# Altium schematic sheet [06] - 8051.SchDoc: Mantra Display Board
size A4; Author: MikrySoft; Address1: MikrySoft@gmail.com; DocumentNumber: 7; Revision: 1; SheetNumber: 7; SheetTotal: 7
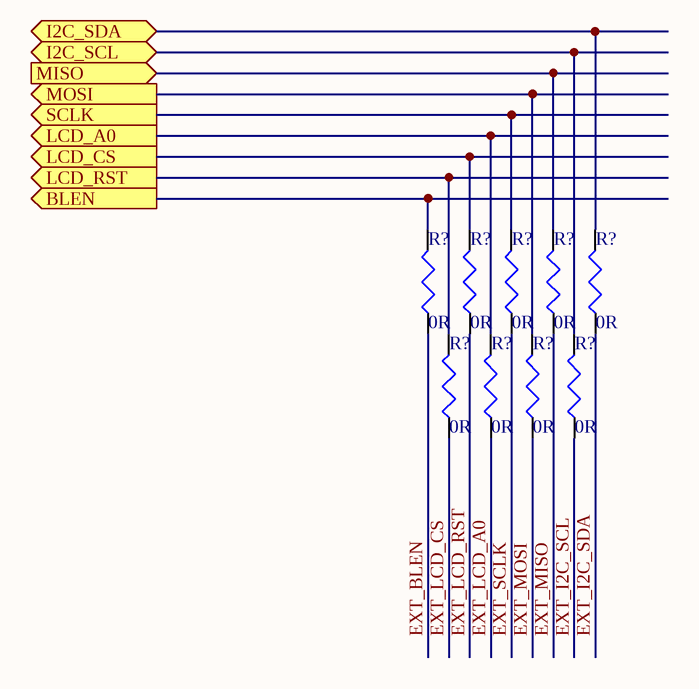
[diagram p0: [06] - 8051.SchDoc]

## Parts
(Parts that share a designator on the sheet are numbered #1, #2 ... from top to bottom, then left to right.)
R?#1  value 0R  [J1-0603]  (hidden comment: Res3)
R?#2  value 0R  [J1-0603]  (hidden comment: Res3)
R?#3  value 0R  [J1-0603]  (hidden comment: Res3)
R?#4  value 0R  [J1-0603]  (hidden comment: Res3)
R?#5  value 0R  [J1-0603]  (hidden comment: Res3)
R?#6  value 0R  [J1-0603]  (hidden comment: Res3)
R?#7  value 0R  [J1-0603]  (hidden comment: Res3)
R?#8  value 0R  [J1-0603]  (hidden comment: Res3)
R?#9  value 0R  [J1-0603]  (hidden comment: Res3)

## Ports
BLEN (out), I2C_SCL (bidir), I2C_SDA (bidir), LCD_A0 (out), LCD_CS (out), LCD_RST (out), MISO (in), MOSI (out), SCLK (out)

## Nets
BLEN: R?#1.2 ; port BLEN
EXT_BLEN: R?#1.1
EXT_I2C_SCL: R?#9.1
EXT_I2C_SDA: R?#5.1
EXT_LCD_A0: R?#7.1
EXT_LCD_CS: R?#6.1
EXT_LCD_RST: R?#2.1
EXT_MISO: R?#4.1
EXT_MOSI: R?#8.1
EXT_SCLK: R?#3.1
I2C_SCL: R?#9.2 ; port I2C_SCL
I2C_SDA: R?#5.2 ; port I2C_SDA
LCD_A0: R?#7.2 ; port LCD_A0
LCD_CS: R?#2.2 ; port LCD_CS
LCD_RST: R?#6.2 ; port LCD_RST
MISO: R?#4.2 ; port MISO
MOSI: R?#8.2 ; port MOSI
SCLK: R?#3.2 ; port SCLK

## Notes on the sheet
- Title
- Size:
- Date:
- A4
- Number:
- Time:
- Revision:
- Sheet
- of
- Variation:
- Author:
- E-Mail:
- File:

## Library data of the parts
R?#1-R?#9 = Res3: Resistor; Published: 8-Jun-2000; LatestRevisionDate: 29-May-2009; LatestRevisionNote: IPC-7351 Footprint Added.; PackageReference: J1-0603; Publisher: Altium Limited; PackageDescription: Chip Resistor